# EAGLE schematic Replicape (EAGLE 5.11)
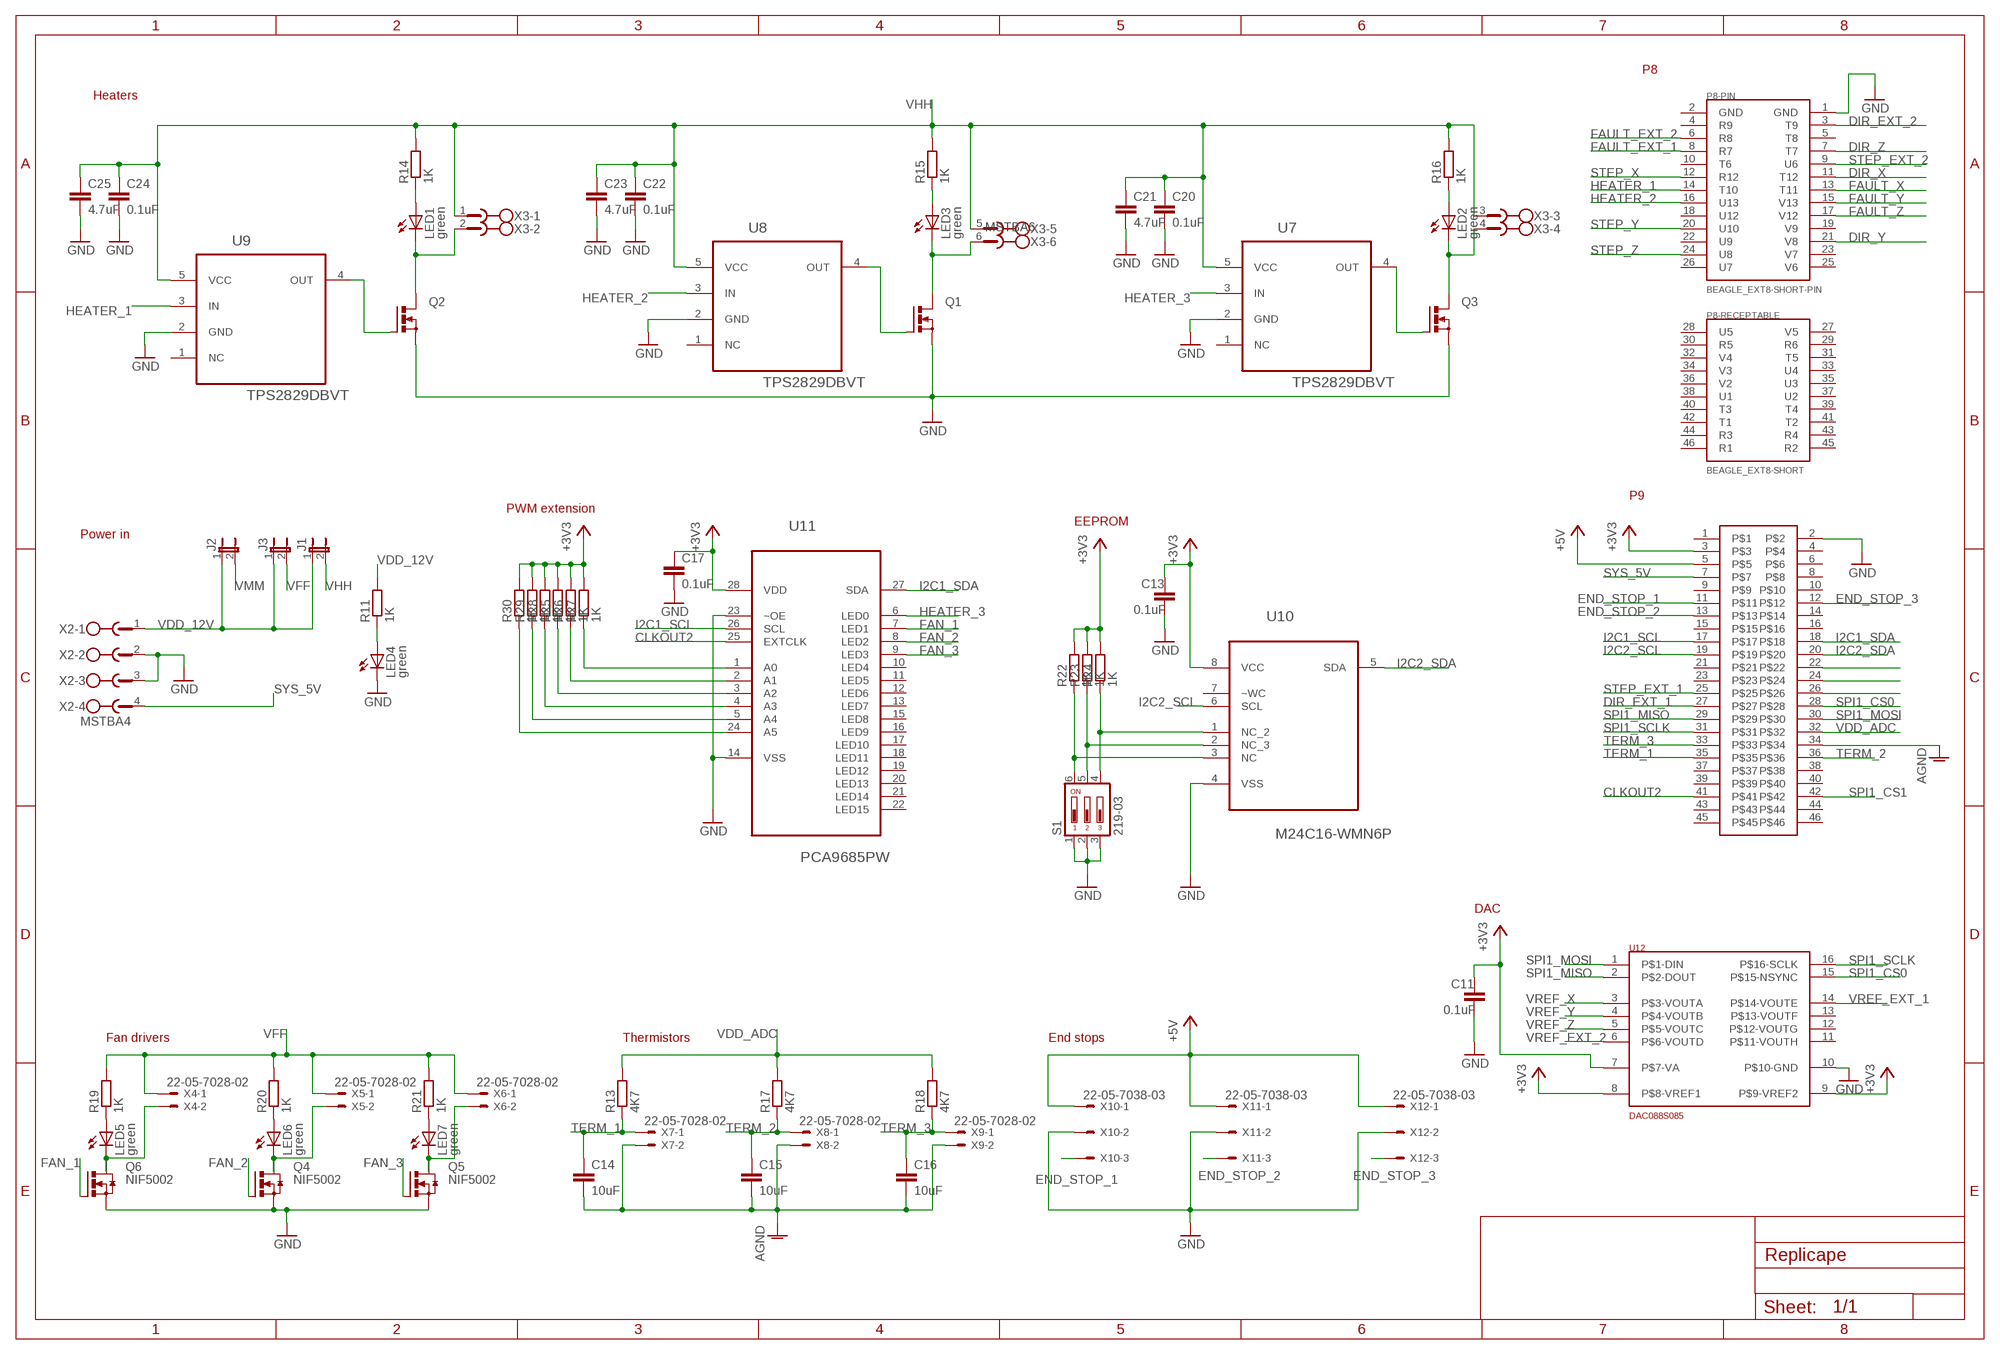
[diagram p0: schematic, sheet 1, part 1 of 2]
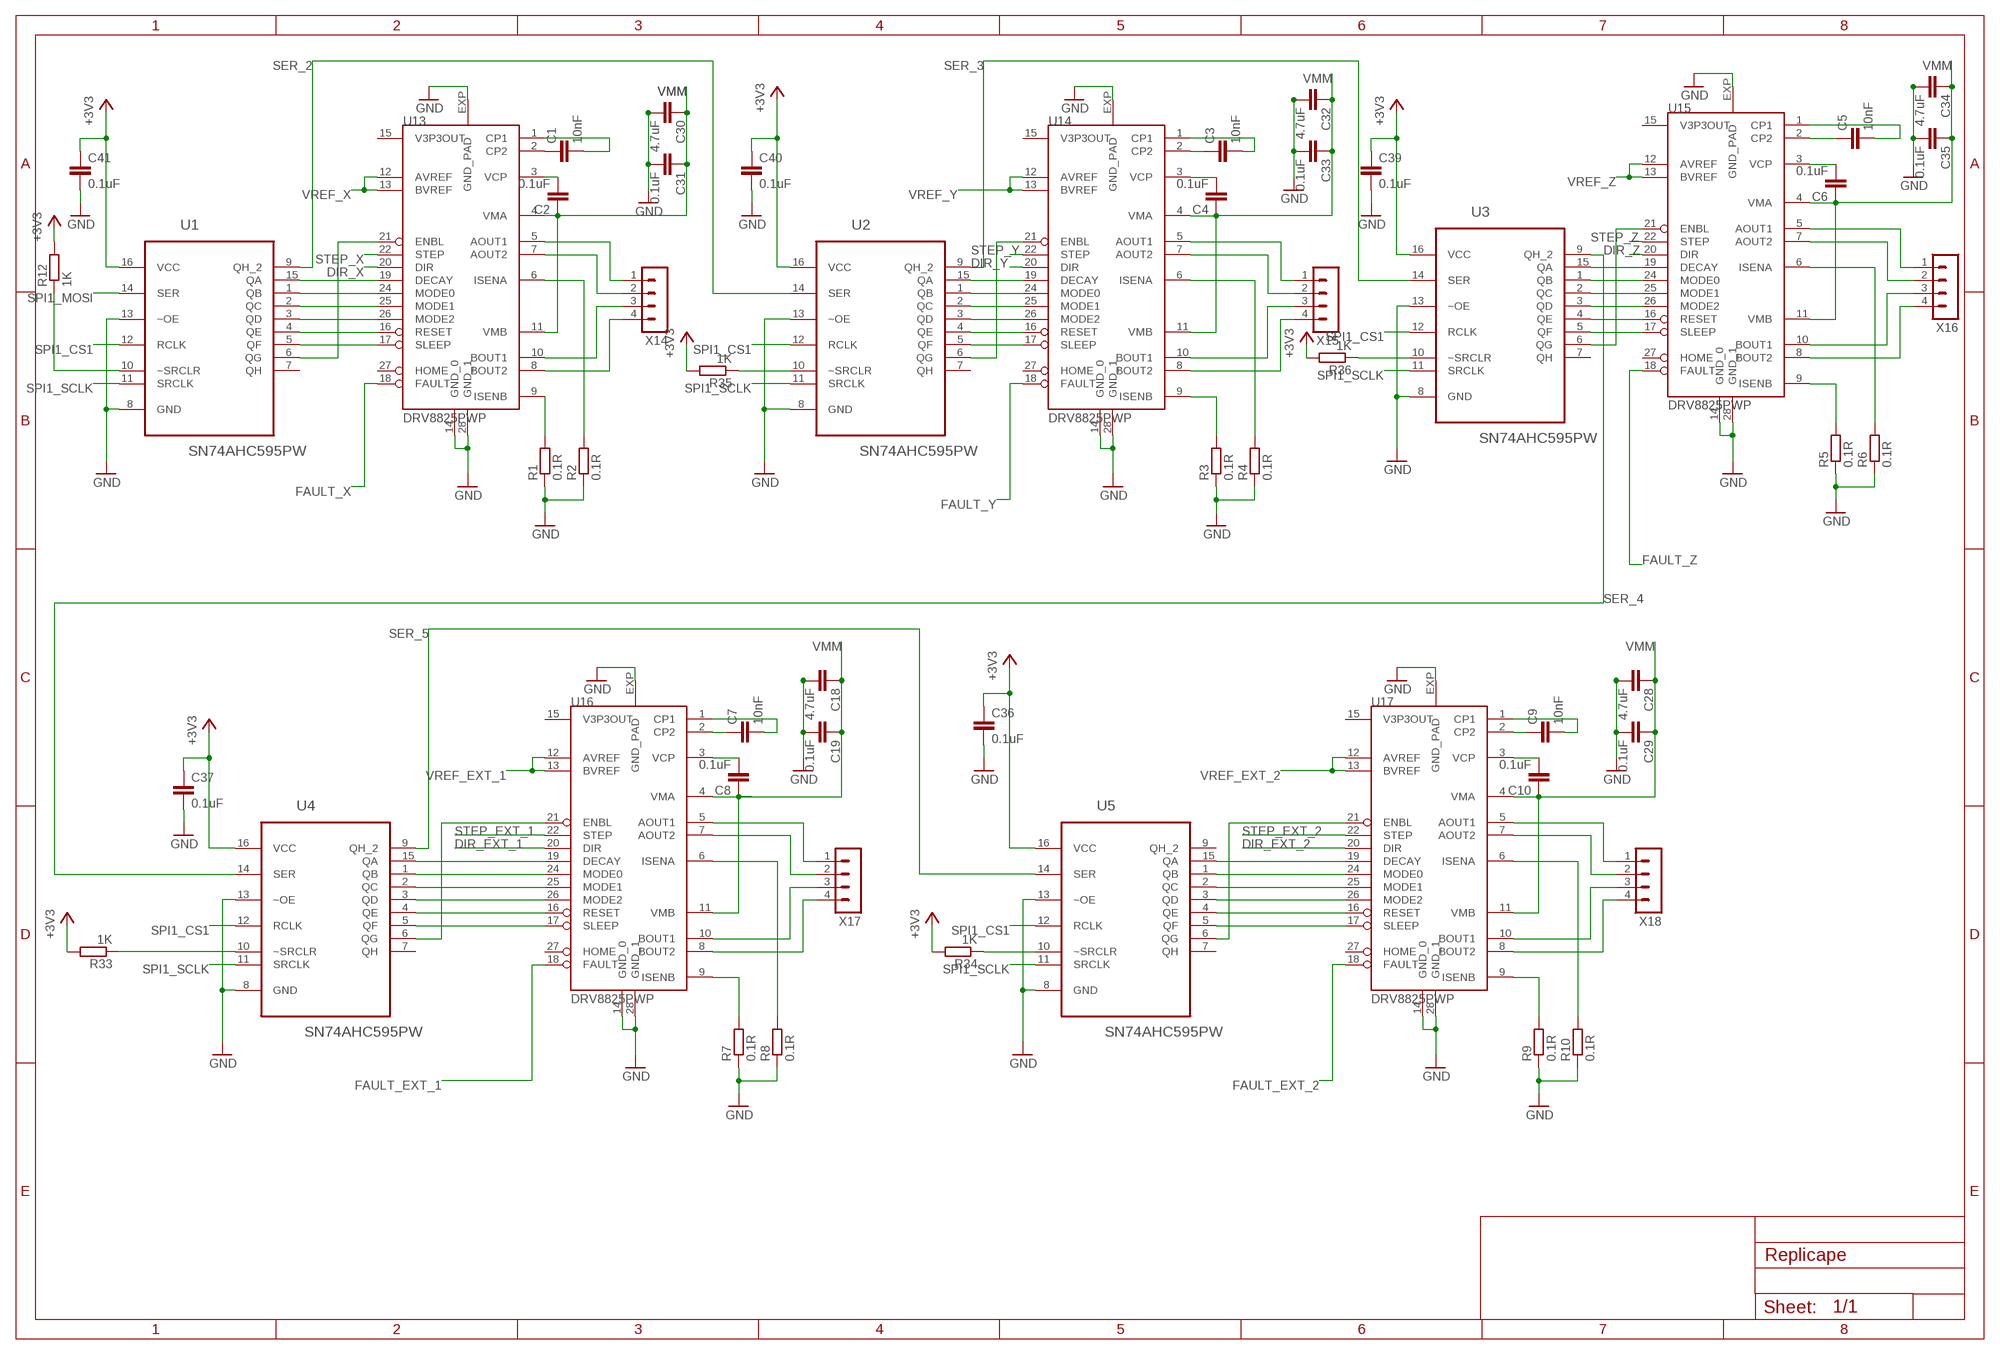
[diagram p1: schematic, sheet 1, part 2 of 2]

## Parts
C1  10nF  C-EUC0603  [C0603]
C2  0.1uF  C-EUC0603  [C0603]
C3  10nF  C-EUC0603  [C0603]
C4  0.1uF  C-EUC0603  [C0603]
C5  10nF  C-EUC0603  [C0603]
C6  0.1uF  C-EUC0603  [C0603]
C7  10nF  C-EUC0603  [C0603]
C8  0.1uF  C-EUC0603  [C0603]
C9  10nF  C-EUC0603  [C0603]
C10  0.1uF  C-EUC0603  [C0603]
C11  0.1uF  C-EUC0402  [C0402]
C13  0.1uF  C-EUC0402  [C0402]
C14  10uF  C-EUC0805  [C0805]
C15  10uF  C-EUC0805  [C0805]
C16  10uF  C-EUC0805  [C0805]
C17  0.1uF  C-EUC0402  [C0402]
C18  4.7uF  C-EUC0603  [C0603]
C19  0.1uF  C-EUC0603  [C0603]
C20  0.1uF  C-EUC0402  [C0402]
C21  4.7uF  C-EUC0603  [C0603]
C22  0.1uF  C-EUC0402  [C0402]
C23  4.7uF  C-EUC0603  [C0603]
C24  0.1uF  C-EUC0402  [C0402]
C25  4.7uF  C-EUC0603  [C0603]
C28  4.7uF  C-EUC0603  [C0603]
C29  0.1uF  C-EUC0603  [C0603]
C30  4.7uF  C-EUC0603  [C0603]
C31  0.1uF  C-EUC0603  [C0603]
C32  4.7uF  C-EUC0603  [C0603]
C33  0.1uF  C-EUC0603  [C0603]
C34  4.7uF  C-EUC0603  [C0603]
C35  0.1uF  C-EUC0603  [C0603]
C36  0.1uF  C-EUC0603  [C0603]
C37  0.1uF  C-EUC0603  [C0603]
C39  0.1uF  C-EUC0603  [C0603]
C40  0.1uF  C-EUC0603  [C0603]
C41  0.1uF  C-EUC0603  [C0603]
J1  JP1E  [JP1]
J2  JP1E  [JP1]
J3  JP1E  [JP1]
LED1  green  LEDCHIP-LED0603  [CHIP-LED0603]
LED2  green  LEDCHIP-LED0603  [CHIP-LED0603]
LED3  green  LEDCHIP-LED0603  [CHIP-LED0603]
LED4  green  LEDCHIP-LED0603  [CHIP-LED0603]
LED5  green  LEDCHIP-LED0603  [CHIP-LED0603]
LED6  green  LEDCHIP-LED0603  [CHIP-LED0603]
LED7  green  LEDCHIP-LED0603  [CHIP-LED0603]
P8-PIN  BEAGLE_EXT8-SHORT-PIN  [2X13]
P8-RECEPTABLE  BEAGLE_EXT8-SHORT  [2X10]
P9-EXPANSION_A  BEAGLE_EXT9  BEAGLE_EXT9RECEPTACLES  [2X23-R]
Q1  PMOSFET_NTO220BV  [TO220BV]
Q2  PMOSFET_NTO220BV  [TO220BV]
Q3  PMOSFET_NTO220BV  [TO220BV]
Q4  NIF5002  N-HEXFET-2D_SOT232-  [SOT223]
Q5  NIF5002  N-HEXFET-2D_SOT232-  [SOT223]
Q6  NIF5002  N-HEXFET-2D_SOT232-  [SOT223]
R1  0.1R  R-EU_R0805  [R0805]
R2  0.1R  R-EU_R0805  [R0805]
R3  0.1R  R-EU_R0805  [R0805]
R4  0.1R  R-EU_R0805  [R0805]
R5  0.1R  R-EU_R0805  [R0805]
R6  0.1R  R-EU_R0805  [R0805]
R7  0.1R  R-EU_R0805  [R0805]
R8  0.1R  R-EU_R0805  [R0805]
R9  0.1R  R-EU_R0805  [R0805]
R10  0.1R  R-EU_R0805  [R0805]
R11  1K  R-EU_R0402  [R0402]
R12  1K  R-EU_R0402  [R0402]
R13  4K7  R-EU_R0402  [R0402]
R14  1K  R-EU_R0402  [R0402]
R15  1K  R-EU_R0402  [R0402]
R16  1K  R-EU_R0402  [R0402]
R17  4K7  R-EU_R0402  [R0402]
R18  4K7  R-EU_R0402  [R0402]
R19  1K  R-EU_R0402  [R0402]
R20  1K  R-EU_R0402  [R0402]
R21  1K  R-EU_R0402  [R0402]
R22  1K  R-EU_R0402  [R0402]
R23  1K  R-EU_R0402  [R0402]
R24  1K  R-EU_R0402  [R0402]
R25  1K  R-EU_R0402  [R0402]
R26  1K  R-EU_R0402  [R0402]
R27  1K  R-EU_R0402  [R0402]
R28  1K  R-EU_R0402  [R0402]
R29  1K  R-EU_R0402  [R0402]
R30  1K  R-EU_R0402  [R0402]
R33  1K  R-EU_R0402  [R0402]
R34  1K  R-EU_R0402  [R0402]
R35  1K  R-EU_R0402  [R0402]
R36  1K  R-EU_R0402  [R0402]
S1  219-03  [CTS-219-03]
U1  SN74AHC595PW  [SOP65P640X120-16N]
U2  SN74AHC595PW  [SOP65P640X120-16N]
U3  SN74AHC595PW  [SOP65P640X120-16N]
U4  SN74AHC595PW  [SOP65P640X120-16N]
U5  SN74AHC595PW  [SOP65P640X120-16N]
U7  TPS2829DBVT  [SOT95P280X145-5N]
U8  TPS2829DBVT  [SOT95P280X145-5N]
U9  TPS2829DBVT  [SOT95P280X145-5N]
U10  M24C16-WMN6P  [SOIC127P600X175-8N]
U11  PCA9685PW  [SOP65P640X110-28N]
U12  DAC088S085  [TSSOP-16]
U13  DRV8825PWP  [TSSOP-28]
U14  DRV8825PWP  [TSSOP-28]
U15  DRV8825PWP  [TSSOP-28]
U16  DRV8825PWP  [TSSOP-28]
U17  DRV8825PWP  [TSSOP-28]
X2  MSTBA4  [MSTBA4]
X3  MSTBA6  [MSTBA6]
X4  22-05-7028-02  [7395-02]
X5  22-05-7028-02  [7395-02]
X6  22-05-7028-02  [7395-02]
X7  22-05-7028-02  [7395-02]
X8  22-05-7028-02  [7395-02]
X9  22-05-7028-02  [7395-02]
X10  22-05-7038-03  [7395-03]
X11  22-05-7038-03  [7395-03]
X12  22-05-7038-03  [7395-03]
X14  MA04-1  [MA04-1]
X15  MA04-1  [MA04-1]
X16  MA04-1  [MA04-1]
X17  MA04-1  [MA04-1]
X18  MA04-1  [MA04-1]

## Nets
+3V3: C11.1 C13.1 C17.1 C36.1 C37.1 C39.1 C40.1 C41.1 P9-EXPANSION_A.3 R12.2 R22.2 R23.2 R24.2 R25.2 R26.2 R27.2 R28.2 R29.2 R30.2 R33.2 R34.2 R35.2 R36.2 U1.16(VCC) U2.16(VCC) U3.16(VCC) U4.16(VCC) U5.16(VCC) U10.8(VCC) U11.28(VDD) U12.7(P$7-VA) U12.8(P$8-VREF1) U12.9(P$9-VREF2)
+5V: P9-EXPANSION_A.5 X10.1 X11.1 X12.1
AGND: C14.2 C15.2 C16.2 P9-EXPANSION_A.34 X7.2 X8.2 X9.2
CLKOUT2: P9-EXPANSION_A.41 U11.25(EXTCLK)
DIR_EXT_1: P9-EXPANSION_A.27 U16.20(DIR)
DIR_EXT_2: P8-PIN.3(T9) U17.20(DIR)
DIR_X: P8-PIN.11(T12) U13.20(DIR)
DIR_Y: P8-PIN.21(V8) U14.20(DIR)
DIR_Z: P8-PIN.7(T7) U15.20(DIR)
END_STOP_1: P9-EXPANSION_A.11 X10.3
END_STOP_2: P9-EXPANSION_A.13 X11.3
END_STOP_3: P9-EXPANSION_A.12 X12.3
FAN_1: Q6.1(G) U11.7(LED1)
FAN_2: Q4.1(G) U11.8(LED2)
FAN_3: Q5.1(G) U11.9(LED3)
FAULT_EXT_1: P8-PIN.8(R7) U16.18(FAULT)
FAULT_EXT_2: P8-PIN.6(R8) U17.18(FAULT)
FAULT_X: P8-PIN.13(T11) U13.18(FAULT)
FAULT_Y: P8-PIN.15(V13) U14.18(FAULT)
FAULT_Z: P8-PIN.17(V12) U15.18(FAULT)
GND: C11.2 C13.2 C17.2 C18.2 C19.2 C20.2 C21.2 C22.2 C23.2 C24.2 C25.2 C28.2 C29.2 C30.2 C31.2 C32.2 C33.2 C34.2 C35.2 C36.2 C37.2 C39.2 C40.2 C41.2 LED4.C P8-PIN.1(GND) P9-EXPANSION_A.2 Q1.S Q2.S Q3.S Q4.3(S) Q5.3(S) Q6.3(S) R1.1 R2.1 R3.1 R4.1 R5.1 R6.1 R7.1 R8.1 R9.1 R10.1 S1.1 S1.2 S1.3 U1.8(GND) U1.13(~OE) U2.8(GND) U2.13(~OE) U3.8(GND) U3.13(~OE) U4.8(GND) U4.13(~OE) U5.8(GND) U5.13(~OE) U7.2(GND) U8.2(GND) U9.2(GND) U10.4(VSS) U11.14(VSS) U11.23(~OE) U12.10(P$10-GND) U13.14(GND_0) U13.28(GND_1) U13.EXP(GND_PAD) U14.14(GND_0) U14.28(GND_1) U14.EXP(GND_PAD) U15.14(GND_0) U15.28(GND_1) U15.EXP(GND_PAD) U16.14(GND_0) U16.28(GND_1) U16.EXP(GND_PAD) U17.14(GND_0) U17.28(GND_1) U17.EXP(GND_PAD) X2.2 X2.3 X10.2 X11.2 X12.2
HEATER_1: P8-PIN.14(T10) U9.3(IN)
HEATER_2: P8-PIN.16(U13) U8.3(IN)
HEATER_3: U7.3(IN) U11.6(LED0)
I2C1_SCL: P9-EXPANSION_A.17 U11.26(SCL)
I2C1_SDA: P9-EXPANSION_A.18 U11.27(SDA)
I2C2_SCL: P9-EXPANSION_A.19 U10.6(SCL)
I2C2_SDA: P9-EXPANSION_A.20 U10.5(SDA)
N$1: U1.15(QA) U13.19(DECAY)
N$2: U1.1(QB) U13.24(MODE0)
N$3: U1.2(QC) U13.25(MODE1)
N$4: U1.3(QD) U13.26(MODE2)
N$5: U1.4(QE) U13.16(RESET)
N$6: U1.5(QF) U13.17(SLEEP)
N$7: U13.5(AOUT1) X14.1
N$9: LED5.A R19.1
N$11: P9-EXPANSION_A.22
N$13: U13.7(AOUT2) X14.2
N$14: U13.10(BOUT1) X14.3
N$15: U13.8(BOUT2) X14.4
N$16: C1.1 U13.2(CP2)
N$17: C1.2 U13.1(CP1)
N$18: R1.2 U13.9(ISENB)
N$19: R2.2 U13.6(ISENA)
N$20: U1.6(QG) U13.21(ENBL)
N$22: C2.2 U13.3(VCP)
N$23: LED3.C Q1.D X3.6
N$24: U2.15(QA) U14.19(DECAY)
N$25: U2.1(QB) U14.24(MODE0)
N$26: U2.2(QC) U14.25(MODE1)
N$27: U2.3(QD) U14.26(MODE2)
N$28: U2.4(QE) U14.16(RESET)
N$29: U2.5(QF) U14.17(SLEEP)
N$30: U14.5(AOUT1) X15.1
N$31: U14.7(AOUT2) X15.2
N$32: U14.10(BOUT1) X15.3
N$33: U14.8(BOUT2) X15.4
N$34: C3.1 U14.2(CP2)
N$35: C3.2 U14.1(CP1)
N$36: R3.2 U14.9(ISENB)
N$37: R4.2 U14.6(ISENA)
N$38: C4.2 U14.3(VCP)
N$39: U2.6(QG) U14.21(ENBL)
N$40: P9-EXPANSION_A.24
N$42: U3.15(QA) U15.19(DECAY)
N$43: U3.1(QB) U15.24(MODE0)
N$44: U3.2(QC) U15.25(MODE1)
N$45: U3.3(QD) U15.26(MODE2)
N$46: U3.4(QE) U15.16(RESET)
N$47: U3.5(QF) U15.17(SLEEP)
N$48: U15.5(AOUT1) X16.1
N$49: U15.7(AOUT2) X16.2
N$50: U15.10(BOUT1) X16.3
N$51: U15.8(BOUT2) X16.4
N$52: C5.1 U15.2(CP2)
N$53: C5.2 U15.1(CP1)
N$54: R5.2 U15.9(ISENB)
N$55: R6.2 U15.6(ISENA)
N$56: C6.2 U15.3(VCP)
N$57: U3.6(QG) U15.21(ENBL)
N$58: R27.1 U11.1(A0)
N$59: R26.1 U11.2(A1)
N$60: U4.15(QA) U16.19(DECAY)
N$61: U4.1(QB) U16.24(MODE0)
N$62: U4.2(QC) U16.25(MODE1)
N$63: U4.3(QD) U16.26(MODE2)
N$64: U4.4(QE) U16.16(RESET)
N$65: U4.5(QF) U16.17(SLEEP)
N$66: U16.5(AOUT1) X17.1
N$67: U16.7(AOUT2) X17.2
N$68: U16.10(BOUT1) X17.3
N$69: U16.8(BOUT2) X17.4
N$70: C7.1 U16.2(CP2)
N$71: C7.2 U16.1(CP1)
N$72: R7.2 U16.9(ISENB)
N$73: R8.2 U16.6(ISENA)
N$74: C8.2 U16.3(VCP)
N$75: U4.6(QG) U16.21(ENBL)
N$76: R25.1 U11.3(A2)
N$78: U5.15(QA) U17.19(DECAY)
N$79: U5.1(QB) U17.24(MODE0)
N$80: U5.2(QC) U17.25(MODE1)
N$81: U5.3(QD) U17.26(MODE2)
N$82: U5.4(QE) U17.16(RESET)
N$83: U5.5(QF) U17.17(SLEEP)
N$84: U17.5(AOUT1) X18.1
N$85: U17.7(AOUT2) X18.2
N$86: U17.10(BOUT1) X18.3
N$87: U17.8(BOUT2) X18.4
N$88: C9.1 U17.2(CP2)
N$89: C9.2 U17.1(CP1)
N$90: R9.2 U17.9(ISENB)
N$91: R10.2 U17.6(ISENA)
N$92: C10.2 U17.3(VCP)
N$93: U5.6(QG) U17.21(ENBL)
N$94: R28.1 U11.4(A3)
N$95: R29.1 U11.5(A4)
N$96: LED4.A R11.1
N$97: R12.1 U1.10(~SRCLR)
N$98: R33.1 U4.10(~SRCLR)
N$99: R34.1 U5.10(~SRCLR)
N$100: R35.1 U2.10(~SRCLR)
N$101: R36.1 U3.10(~SRCLR)
N$112: R30.1 U11.24(A5)
N$114: LED7.C Q5.2(D) Q5.4(D) X6.2
N$115: LED6.C Q4.2(D) Q4.4(D) X5.2
N$116: LED5.C Q6.2(D) Q6.4(D) X4.2
N$117: LED6.A R20.1
N$118: LED7.A R21.1
N$127: LED3.A R15.1
N$128: LED1.C Q2.D X3.2
N$129: LED1.A R14.1
N$130: LED2.A R16.1
N$131: LED2.C Q3.D X3.4
N$132: Q2.G U9.4(OUT)
N$133: Q1.G U8.4(OUT)
N$134: Q3.G U7.4(OUT)
N$142: P9-EXPANSION_A.26
N$147: R24.1 S1.4 U10.1(NC_2)
N$148: R23.1 S1.5 U10.2(NC_3)
N$149: R22.1 S1.6 U10.3(NC)
SER_2: U1.9(QH_2) U2.14(SER)
SER_3: U2.9(QH_2) U3.14(SER)
SER_4: U3.9(QH_2) U4.14(SER)
SER_5: U4.9(QH_2) U5.14(SER)
SPI1_CS0: P9-EXPANSION_A.28 U12.15(P$15-NSYNC)
SPI1_CS1: P9-EXPANSION_A.42 U1.12(RCLK) U2.12(RCLK) U3.12(RCLK) U4.12(RCLK) U5.12(RCLK)
SPI1_MISO: P9-EXPANSION_A.29 U12.2(P$2-DOUT)
SPI1_MOSI: P9-EXPANSION_A.30 U1.14(SER) U12.1(P$1-DIN)
SPI1_SCLK: P9-EXPANSION_A.31 U1.11(SRCLK) U2.11(SRCLK) U3.11(SRCLK) U4.11(SRCLK) U5.11(SRCLK) U12.16(P$16-SCLK)
STEP_EXT_1: P9-EXPANSION_A.25 U16.22(STEP)
STEP_EXT_2: P8-PIN.9(U6) U17.22(STEP)
STEP_X: P8-PIN.12(R12) U13.22(STEP)
STEP_Y: P8-PIN.20(U10) U14.22(STEP)
STEP_Z: P8-PIN.24(U8) U15.22(STEP)
SYS_5V: P9-EXPANSION_A.7 X2.4
TERM_1: C14.1 P9-EXPANSION_A.35 R13.1 X7.1
TERM_2: C15.1 P9-EXPANSION_A.36 R17.1 X8.1
TERM_3: C16.1 P9-EXPANSION_A.33 R18.1 X9.1
VDD_12V: J1.1 J2.1 J3.1 R11.2 X2.1
VDD_ADC: P9-EXPANSION_A.32 R13.2 R17.2 R18.2
VFF: J3.2 R19.2 R20.2 R21.2 X4.1 X5.1 X6.1
VHH: C20.1 C21.1 C22.1 C23.1 C24.1 C25.1 J1.2 R14.2 R15.2 R16.2 U7.5(VCC) U8.5(VCC) U9.5(VCC) X3.1 X3.3 X3.5
VMM: C2.1 C4.1 C6.1 C8.1 C10.1 C18.1 C19.1 C28.1 C29.1 C30.1 C31.1 C32.1 C33.1 C34.1 C35.1 J2.2 U13.4(VMA) U13.11(VMB) U14.4(VMA) U14.11(VMB) U15.4(VMA) U15.11(VMB) U16.4(VMA) U16.11(VMB) U17.4(VMA) U17.11(VMB)
VREF_EXT_1: U12.14(P$14-VOUTE) U16.12(AVREF) U16.13(BVREF)
VREF_EXT_2: U12.6(P$6-VOUTD) U17.12(AVREF) U17.13(BVREF)
VREF_X: U12.3(P$3-VOUTA) U13.12(AVREF) U13.13(BVREF)
VREF_Y: U12.4(P$4-VOUTB) U14.12(AVREF) U14.13(BVREF)
VREF_Z: U12.5(P$5-VOUTC) U15.12(AVREF) U15.13(BVREF)
Unconnected: P8-PIN.4(R9) P8-PIN.5(T8) P8-PIN.10(T6) P8-PIN.18(U12) P8-PIN.19(V9) P8-PIN.22(U9) P8-PIN.23(V7) P8-PIN.25(V6) P8-PIN.26(U7) P8-RECEPTABLE.27(V5) P8-RECEPTABLE.28(U5) P8-RECEPTABLE.29(R6) P8-RECEPTABLE.30(R5) P8-RECEPTABLE.31(T5) P8-RECEPTABLE.32(V4) P8-RECEPTABLE.33(U4) P8-RECEPTABLE.34(V3) P8-RECEPTABLE.35(U3) P8-RECEPTABLE.36(V2) P8-RECEPTABLE.37(U2) P8-RECEPTABLE.38(U1) P8-RECEPTABLE.39(T4) P8-RECEPTABLE.40(T3) P8-RECEPTABLE.41(T2) P8-RECEPTABLE.42(T1) P8-RECEPTABLE.43(R4) P8-RECEPTABLE.44(R3) P8-RECEPTABLE.45(R2) P8-RECEPTABLE.46(R1) P9-EXPANSION_A.1 P9-EXPANSION_A.4 P9-EXPANSION_A.6 P9-EXPANSION_A.8 P9-EXPANSION_A.9 P9-EXPANSION_A.10 P9-EXPANSION_A.14 P9-EXPANSION_A.15 P9-EXPANSION_A.16 P9-EXPANSION_A.21 P9-EXPANSION_A.23 P9-EXPANSION_A.37 P9-EXPANSION_A.38 P9-EXPANSION_A.39 P9-EXPANSION_A.40 P9-EXPANSION_A.43 P9-EXPANSION_A.44 P9-EXPANSION_A.45 P9-EXPANSION_A.46 U1.7(QH) U2.7(QH) U3.7(QH) U4.7(QH) U5.7(QH) U5.9(QH_2) U7.1(NC) U8.1(NC) U9.1(NC) U10.7(~WC) U11.10(LED4) U11.11(LED5) U11.12(LED6) U11.13(LED7) U11.15(LED8) U11.16(LED9) U11.17(LED10) U11.18(LED11) U11.19(LED12) U11.20(LED13) U11.21(LED14) U11.22(LED15) U12.11(P$11-VOUTH) U12.12(P$12-VOUTG) U12.13(P$13-VOUTF) U13.15(V3P3OUT) U13.27(HOME) U14.15(V3P3OUT) U14.27(HOME) U15.15(V3P3OUT) U15.27(HOME) U16.15(V3P3OUT) U16.27(HOME) U17.15(V3P3OUT) U17.27(HOME)

## Notes on the sheet
- P8
- Heaters
- P9
- PWM extension
- EEPROM
- Power in
- DAC
- Fan drivers | Thermistors | End stops

## Power pins joined to a net without a drawn wire
GND: P8-PIN.2(GND)

## Library data of the parts
C1-C11 C13-C25 C28-C37 C39-C41 = rcl:C-EU: CAPACITOR, European symbol
J1-J3 = jumper:JP1E: JUMPER
LED1-LED7 = led:LED: LED OSRAM: - CHIPLED LG R971, LG N971, LY N971, LG Q971, LY Q971, LO R971, LY R971 LH N974, LH R974 LS Q976, LO Q976, LY Q976 LO Q996 - Hyper CHIPLED LW Q18S LB Q993, LB Q99A, LB R99A - SideLED LS A670, LO A670, LY A670, LG A670, LP A670 LB A673, LV A673, LT A673, LW A673 LH A674 LY A675 LS A676, LA A676, LO A676, LY A676, LW A676 LS A679, LY A679, LG A679 - Hyper Micro SIDELED® LS Y876, LA Y876, LO Y876, LY Y876 LT Y87S - SmartLED LW L88C, LW L88S LB L89C, LB L89S, LG L890 LS L89K, LO L89K, LY L89K LS L896, LA L896, LO L896, LY L896 - TOPLED LS T670, LO T670, LY T670, LG T670, LP T670 LSG T670, LSP T670, LSY T670, LOP T670, LYG T670 LG T671, LOG T671, LSG T671 LB T673, LV T673, LT T673, LW T673 LH T674 LS T676, LA T676, LO T676, LY T676, LB T676, LH T676, LSB T676, LW T676 LB T67C, LV T67C, LT T67C, LS T67K, LO T67K, LY T67K, LW E67C LS E67B, LA E67B, LO E67B, LY E67B, LB E67C, LV E67C, LT E67C LW T67C LS T679, LY T679, LG T679 LS T770, LO T770, LY T770, LG T770, LP T770 LB T773, LV T773, LT T773, LW T773 LH T774 LS E675, LA E675, LY E675, LS T675 LS T776, LA T776, LO T776, LY T776, LB T776 LHGB T686 LT T68C, LB T68C - Hyper Mini TOPLED® LB M676 - Mini TOPLED Santana® LG M470 LS M47K, LO M47K, LY M47K Source: http://www.osram.convergy.de LUXEON: - LUMILED® LXK2-PW12-R00, LXK2-PW12-S00, LXK2-PW14-U00, LXK2-PW14-V00 LXK2-PM12-R00, LXK2-PM12-S00, LXK2-PM14-U00 LXK2-PE12-Q00, LXK2-PE12-R00, LXK2-PE12-S00, LXK2-PE14-T00, LXK2-PE14-U00 LXK2-PB12-K00, LXK2-PB12-L00, LXK2-PB12-M00, LXK2-PB14-N00, LXK2-PB14-P00, LXK2-PB14-Q00 LXK2-PR12-L00, LXK2-PR12-M00, LXK2-PR14-Q00, LXK2-PR14-R00 LXK2-PD12-Q00, LXK2-PD12-R00, LXK2-PD12-S00 LXK2-PH12-R00, LXK2-PH12-S00 LXK2-PL12-P00, LXK2-PL12-Q00, LXK2-PL12-R00 Source: www.luxeon.com KINGBRIGHT: KA-3528ASYC Source: www.kingbright.com
P8-PIN = custom:BEAGLE_EXT8-SHORT-PIN
P8-RECEPTABLE = custom:BEAGLE_EXT8-SHORT
P9-EXPANSION_A = custom:BEAGLE_EXT9
Q1-Q3 = transistor-power:PMOSFET_N: Power MOSFET N-Channel
Q4-Q6 = transistor-power:N-HEXFET-2D_?-*: HEXFET® Power MOSFET 2 Drain connects http://www.irf.com/product-info/datasheets/data/irll014n.pdf
R1-R30 R33-R36 = rcl:R-EU_: RESISTOR, European symbol
S1 = switch-dil:219-03*: Surface Mount DIP Switch Series 219 SMT CTS Electronic Components Sourc: www.ctscorp.com; OC_FARNELL: unknown; OC_NEWARK: unknown
U1-U5 = sn74hc595:SN74AHC595PW: 8 bit shift registers with 3-state output registers; MPN: SN74AHC595PW; OC_FARNELL: 1741463; OC_NEWARK: 50R5930; PACKAGE: TSSOP-16; SUPPLIER: Texas Instruments
U7-U9 = custom:TPS2829DBVT: Single Channel high speed Mosfet Driver; MPN: TPS2829DBVT; OC_FARNELL: 8456992; OC_NEWARK: 95H4553; PACKAGE: SOT-23-5; SUPPLIER: Texas Instruments
U10 = custom:M24C16-WMN6P: serial I²C bus EEPROM; MPN: M24C16-WMN6P; OC_FARNELL: 9882774; OC_NEWARK: 24M5071; PACKAGE: SOIC-8; SUPPLIER: STMicroelectronics
U11 = custom:PCA9685PW: 16-channel, 12-bit PWM Fm+ I2C-bus LED controller; MPN: PCA9685PW; OC_FARNELL: 1854074; OC_NEWARK: 19T6398; PACKAGE: TSSOP-28; SUPPLIER: NXP
U12 = dac88s:DAC088S085
U13-U17 = drv88xx:DRV8825PWP
X2 = con-phoenix-508:MSTBA4: PHOENIX; MF: FARNELL; MPN: 1757268; OC_FARNELL: 3705195; OC_NEWARK: 71C4163
X3 = con-phoenix-508:MSTBA6: PHOENIX; MF: FARNELL; MPN: 1757284; OC_FARNELL: 3705213; OC_NEWARK: 71C4165
X4-X9 = con-molex:22-?-02: CONNECTOR wire to board 2.54 mm (.1 inch) pitch header; OC_FARNELL: 9731601; OC_NEWARK: unknown
X10-X12 = con-molex:22-?-03: CONNECTOR wire to board 2.54 mm (.1 inch) pitch header; OC_FARNELL: unknown; OC_NEWARK: unknown
X14-X18 = con-lstb:MA04-1: PIN HEADER; OC_FARNELL: unknown; OC_NEWARK: unknown

## Net classes
1 power: width 1.27 mm